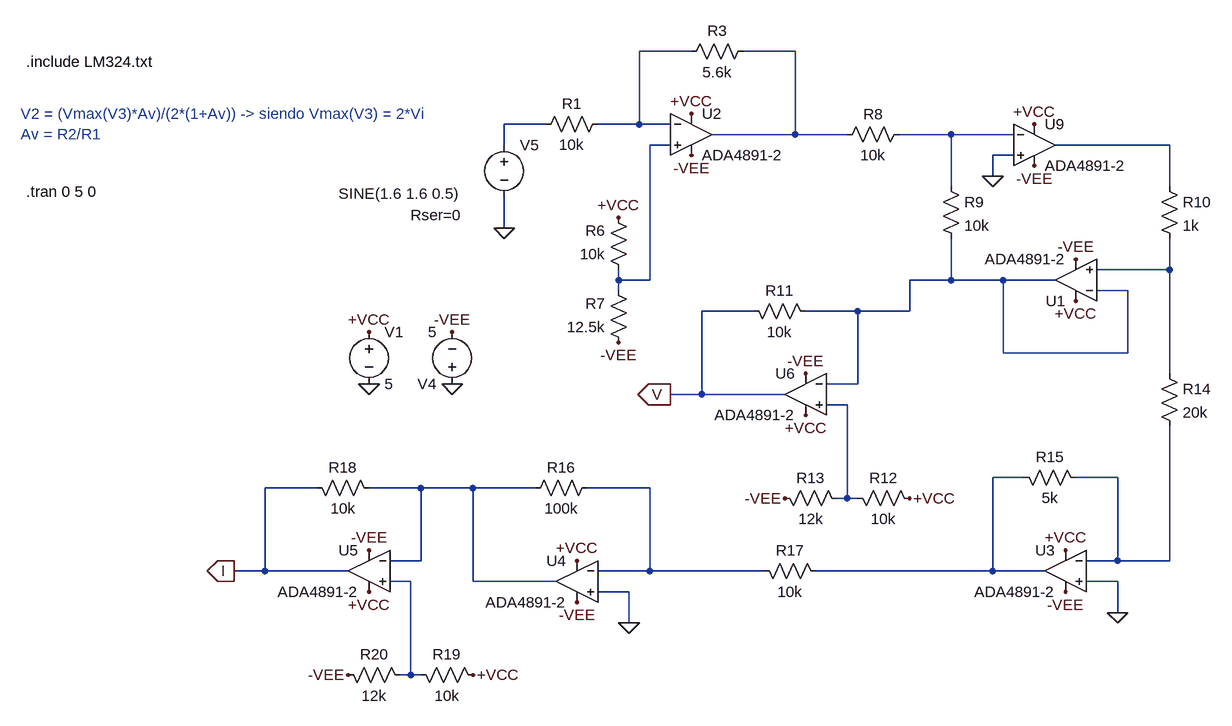
[diagram p0: schematic potenciostato.asc]
potenciostato.asc, the LTspice schematic file:
Version 4
SHEET 1 19688 680
WIRE -912 -384 -992 -384
WIRE -752 -384 -832 -384
WIRE -1136 -272 -1200 -272
WIRE -992 -272 -992 -384
WIRE -992 -272 -1056 -272
WIRE -944 -272 -992 -272
WIRE -752 -256 -752 -384
WIRE -752 -256 -880 -256
WIRE -672 -256 -752 -256
WIRE -512 -256 -592 -256
WIRE -416 -256 -512 -256
WIRE -1200 -240 -1200 -272
WIRE -944 -240 -976 -240
WIRE -176 -240 -352 -240
WIRE -416 -224 -448 -224
WIRE -448 -192 -448 -224
WIRE -512 -176 -512 -256
WIRE -176 -176 -176 -240
WIRE -1200 -112 -1200 -160
WIRE -176 -48 -176 -96
WIRE -176 -48 -288 -48
WIRE -1024 -32 -1024 -48
WIRE -976 -32 -976 -240
WIRE -976 -32 -1024 -32
WIRE -512 -32 -512 -96
WIRE -512 -32 -576 -32
WIRE -432 -32 -512 -32
WIRE -352 -32 -432 -32
WIRE -1024 -16 -1024 -32
WIRE -240 -16 -288 -16
WIRE -816 16 -896 16
WIRE -656 16 -736 16
WIRE -576 16 -576 -32
WIRE -576 16 -656 16
WIRE -432 80 -432 -32
WIRE -240 80 -240 -16
WIRE -240 80 -432 80
WIRE -176 112 -176 -48
WIRE -656 128 -656 16
WIRE -656 128 -704 128
WIRE -896 144 -896 16
WIRE -896 144 -944 144
WIRE -768 144 -896 144
WIRE -672 160 -704 160
WIRE -400 272 -448 272
WIRE -256 272 -320 272
WIRE -1488 288 -1568 288
WIRE -1328 288 -1408 288
WIRE -1248 288 -1328 288
WIRE -1152 288 -1248 288
WIRE -976 288 -1072 288
WIRE -672 304 -672 160
WIRE -672 304 -688 304
WIRE -656 304 -672 304
WIRE -1328 400 -1328 288
WIRE -1328 400 -1376 400
WIRE -256 400 -256 272
WIRE -256 400 -304 400
WIRE -176 400 -176 192
WIRE -176 400 -256 400
WIRE -1568 416 -1568 288
WIRE -1568 416 -1616 416
WIRE -1440 416 -1568 416
WIRE -976 416 -976 288
WIRE -976 416 -1056 416
WIRE -800 416 -976 416
WIRE -448 416 -448 272
WIRE -448 416 -720 416
WIRE -368 416 -448 416
WIRE -1344 432 -1376 432
WIRE -1248 432 -1248 288
WIRE -1120 432 -1248 432
WIRE -256 432 -304 432
WIRE -1008 448 -1056 448
WIRE -256 480 -256 432
WIRE -1008 496 -1008 448
WIRE -1344 576 -1344 432
WIRE -1344 576 -1360 576
WIRE -1328 576 -1344 576
FLAG -912 -288 +VCC
FLAG -1408 128 0
FLAG -1408 48 +VCC
FLAG -1280 128 0
FLAG -1280 48 -VEE
FLAG -912 -224 -VEE
FLAG -1024 -128 +VCC
FLAG -1024 64 -VEE
FLAG -1200 -112 0
FLAG -384 -272 +VCC
FLAG -384 -208 -VEE
FLAG -448 -192 0
FLAG -320 0 +VCC
FLAG -320 -64 -VEE
FLAG -736 176 +VCC
FLAG -736 112 -VEE
FLAG -576 304 +VCC
FLAG -768 304 -VEE
FLAG -944 144 V
IOPIN -944 144 Out
FLAG -336 384 +VCC
FLAG -336 448 -VEE
FLAG -256 480 0
FLAG -1088 400 +VCC
FLAG -1088 464 -VEE
FLAG -1008 496 0
FLAG -1408 448 +VCC
FLAG -1408 384 -VEE
FLAG -1248 576 +VCC
FLAG -1440 576 -VEE
FLAG -1616 416 I
IOPIN -1616 416 Out
SYMBOL voltage -1408 32 R0
WINDOW 123 0 0 Left 2
WINDOW 39 0 0 Left 2
SYMATTR InstName V1
SYMATTR Value 5
SYMBOL res -816 -400 R90
WINDOW 0 0 56 VBottom 2
WINDOW 3 32 56 VTop 2
SYMATTR InstName R3
SYMATTR Value 5.6k
SYMBOL voltage -1280 144 R180
WINDOW 123 0 0 Left 2
WINDOW 39 0 0 Left 2
SYMATTR InstName V4
SYMATTR Value 5
SYMBOL res -1008 -32 R180
WINDOW 0 36 76 Left 2
WINDOW 3 36 40 Left 2
SYMATTR InstName R6
SYMATTR Value 10k
SYMBOL res -1008 80 R180
WINDOW 0 36 76 Left 2
WINDOW 3 36 40 Left 2
SYMATTR InstName R7
SYMATTR Value 12.5k
SYMBOL voltage -1200 -256 R0
WINDOW 123 0 0 Left 2
WINDOW 39 -144 124 Left 2
WINDOW 3 -255 91 Left 2
SYMATTR SpiceLine Rser=0
SYMATTR Value SINE(1.6 1.6 0.5)
SYMATTR InstName V5
SYMBOL res -576 -272 R90
WINDOW 0 0 56 VBottom 2
WINDOW 3 32 56 VTop 2
SYMATTR InstName R8
SYMATTR Value 10k
SYMBOL res -528 -192 R0
SYMATTR InstName R9
SYMATTR Value 10k
SYMBOL res -192 -192 R0
SYMATTR InstName R10
SYMATTR Value 1k
SYMBOL res -832 0 M90
WINDOW 0 0 56 VBottom 2
WINDOW 3 32 56 VTop 2
SYMATTR InstName R11
SYMATTR Value 10k
SYMBOL res -672 288 M90
WINDOW 0 0 56 VBottom 2
WINDOW 3 32 56 VTop 2
SYMATTR InstName R12
SYMATTR Value 10k
SYMBOL res -784 288 M90
WINDOW 0 0 56 VBottom 2
WINDOW 3 32 56 VTop 2
SYMATTR InstName R13
SYMATTR Value 12k
SYMBOL res -192 96 R0
SYMATTR InstName R14
SYMATTR Value 20k
SYMBOL res -304 288 M270
WINDOW 0 32 56 VTop 2
WINDOW 3 0 56 VBottom 2
SYMATTR InstName R15
SYMATTR Value 5k
SYMBOL res -1168 304 R270
WINDOW 0 32 56 VTop 2
WINDOW 3 0 56 VBottom 2
SYMATTR InstName R16
SYMATTR Value 100k
SYMBOL res -704 432 M270
WINDOW 0 32 56 VTop 2
WINDOW 3 0 56 VBottom 2
SYMATTR InstName R17
SYMATTR Value 10k
SYMBOL res -1504 272 M90
WINDOW 0 0 56 VBottom 2
WINDOW 3 32 56 VTop 2
SYMATTR InstName R18
SYMATTR Value 10k
SYMBOL res -1344 560 M90
WINDOW 0 0 56 VBottom 2
WINDOW 3 32 56 VTop 2
SYMATTR InstName R19
SYMATTR Value 10k
SYMBOL res -1456 560 M90
WINDOW 0 0 56 VBottom 2
WINDOW 3 32 56 VTop 2
SYMATTR InstName R20
SYMATTR Value 12k
SYMBOL res -1040 -288 R90
WINDOW 0 0 56 VBottom 2
WINDOW 3 32 56 VTop 2
SYMATTR InstName R1
SYMATTR Value 10k
SYMBOL OpAmps\\ADA4891-2 -912 -320 R0
SYMATTR InstName U2
SYMBOL OpAmps\\ADA4891-2 -384 -304 R0
SYMATTR InstName U9
SYMBOL OpAmps\\ADA4891-2 -320 32 R180
SYMATTR InstName U1
SYMBOL OpAmps\\ADA4891-2 -336 352 M0
SYMATTR InstName U3
SYMBOL OpAmps\\ADA4891-2 -1088 368 M0
SYMATTR InstName U4
SYMBOL OpAmps\\ADA4891-2 -1408 352 M0
SYMATTR InstName U5
SYMBOL OpAmps\\ADA4891-2 -736 80 M0
SYMATTR InstName U6
TEXT -1936 -168 Left 2 !.tran 0 5 0
TEXT -1944 -288 Left 2 ;V2 = (Vmax(V3)*Av)/(2*(1+Av)) -> siendo Vmax(V3) = 2*Vi\nAv = R2/R1
TEXT -1936 -368 Left 2 !.include LM324.txt

The netlist it stands for:
* potenciostato.asc
V1 +VCC 0 5
R3 N002 N001 5.6k
V4 0 -VEE 5
R6 N005 +VCC 10k
R7 -VEE N005 12.5k
V5 N003 0 SINE(1.6 1.6 0.5) Rser=0
R8 N004 N002 10k
R9 N004 N008 10k
R10 N006 N007 1k
R11 V N008 10k
R12 N009 +VCC 10k
R13 -VEE N009 12k
R14 N007 N011 20k
R15 N011 N010 5k
R16 N012 N013 100k
R17 N010 N013 10k
R18 I N012 10k
R19 N014 +VCC 10k
R20 -VEE N014 12k
R1 N001 N003 10k
XU2 N005 N001 +VCC -VEE N002 ADA4891-2  ; pins In+ In- V+ V- OUT
XU9 0 N004 +VCC -VEE N006 ADA4891-2  ; pins In+ In- V+ V- OUT
XU1 N007 N008 +VCC -VEE N008 ADA4891-2  ; pins In+ In- V+ V- OUT
XU3 0 N011 +VCC -VEE N010 ADA4891-2  ; pins In+ In- V+ V- OUT
XU4 0 N013 +VCC -VEE N012 ADA4891-2  ; pins In+ In- V+ V- OUT
XU5 N014 N012 -VEE +VCC I ADA4891-2  ; pins In+ In- V+ V- OUT
XU6 N009 N008 -VEE +VCC V ADA4891-2  ; pins In+ In- V+ V- OUT
.tran 0 5 0
* V2 = (Vmax(V3)*Av)/(2*(1+Av)) -> siendo Vmax(V3) = 2*Vi
* Av = R2/R1
.include LM324.txt
.backanno
.end